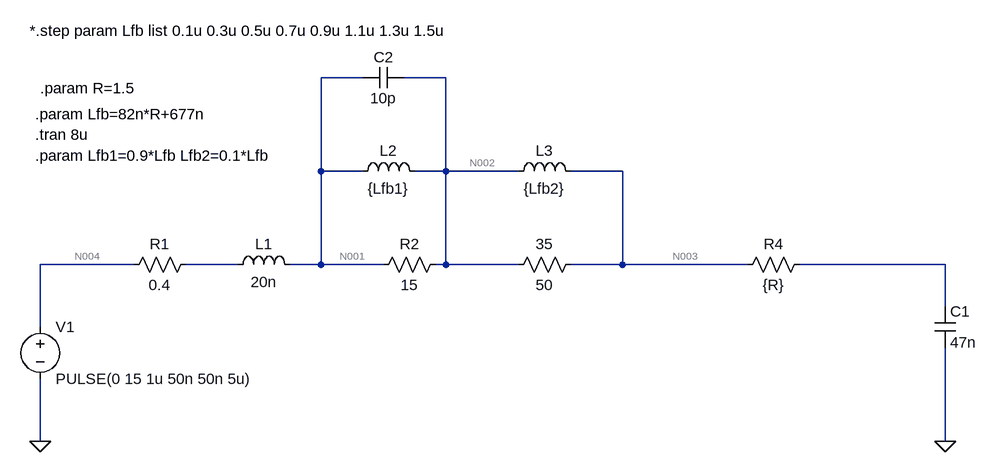
[diagram p0: schematic Draft4.asc]
Draft4.asc, the LTspice schematic file:
Version 4
SHEET 1 1128 680
WIRE 160 -208 96 -208
WIRE 288 -208 224 -208
WIRE 96 -64 96 -208
WIRE 160 -64 96 -64
WIRE 288 -64 288 -208
WIRE 288 -64 240 -64
WIRE 400 -64 288 -64
WIRE 560 -64 480 -64
WIRE -192 80 -336 80
WIRE -32 80 -112 80
WIRE 96 80 96 -64
WIRE 96 80 48 80
WIRE 192 80 96 80
WIRE 288 80 288 -64
WIRE 288 80 272 80
WIRE 400 80 288 80
WIRE 560 80 560 -64
WIRE 560 80 480 80
WIRE 752 80 560 80
WIRE 1056 80 832 80
WIRE 1056 144 1056 80
WIRE -336 176 -336 80
WIRE -336 352 -336 256
WIRE 1056 352 1056 208
FLAG -336 352 0
FLAG 1056 352 0
SYMBOL voltage -336 160 R0
WINDOW 123 0 0 Left 0
WINDOW 39 0 0 Left 0
SYMATTR InstName V1
SYMATTR Value PULSE(0 15 1u 50n 50n 5u)
SYMBOL res -208 96 R270
WINDOW 0 32 56 VTop 2
WINDOW 3 0 56 VBottom 2
SYMATTR InstName R1
SYMATTR Value 0.4
SYMBOL ind -48 96 R270
WINDOW 0 32 56 VTop 2
WINDOW 3 5 56 VBottom 2
SYMATTR InstName L1
SYMATTR Value 20n
SYMATTR SpiceLine Rser=2
SYMBOL res 288 64 R90
WINDOW 0 0 56 VBottom 2
WINDOW 3 32 56 VTop 2
SYMATTR InstName R2
SYMATTR Value 15
SYMBOL ind 144 -48 R270
WINDOW 0 32 56 VTop 2
WINDOW 3 5 56 VBottom 2
SYMATTR InstName L2
SYMATTR Value {Lfb1}
SYMBOL ind 384 -48 R270
WINDOW 0 32 56 VTop 2
WINDOW 3 5 56 VBottom 2
SYMATTR InstName L3
SYMATTR Value {Lfb2}
SYMBOL res 496 64 R90
WINDOW 0 0 56 VBottom 2
WINDOW 3 32 56 VTop 2
SYMATTR InstName 35
SYMATTR Value 50
SYMBOL res 848 64 R90
WINDOW 0 0 56 VBottom 2
WINDOW 3 32 56 VTop 2
SYMATTR InstName R4
SYMATTR Value {R}
SYMBOL cap 1040 144 R0
SYMATTR InstName C1
SYMATTR Value 47n
SYMBOL cap 224 -224 R90
WINDOW 0 0 32 VBottom 2
WINDOW 3 32 32 VTop 2
SYMATTR InstName C2
SYMATTR Value 10p
TEXT -344 -120 Left 2 !.tran 8u
TEXT -344 -152 Left 2 !.param Lfb=82n*R+677n
TEXT -344 -88 Left 2 !.param Lfb1=0.9*Lfb Lfb2=0.1*Lfb
TEXT -352 -280 Left 2 !*.step param Lfb list 0.1u 0.3u 0.5u 0.7u 0.9u 1.1u 1.3u 1.5u
TEXT -336 -192 Left 2 !.param R=1.5

The netlist it stands for:
* Draft4.asc
V1 N004 0 PULSE(0 15 1u 50n 50n 5u)
R1 N004 N005 0.4
L1 N005 N001 20n Rser=2
R2 N002 N001 15
L2 N001 N002 {Lfb1}
L3 N002 N003 {Lfb2}
R§35 N003 N002 50
R4 N006 N003 {R}
C1 N006 0 47n
C2 N002 N001 10p
.tran 8u
.param Lfb=82n*R+677n
.param Lfb1=0.9*Lfb Lfb2=0.1*Lfb
*.step param Lfb list 0.1u 0.3u 0.5u 0.7u 0.9u 1.1u 1.3u 1.5u
.param R=1.5
.backanno
.end

* Results of the author's LTspice run, read from the files saved beside the schematic
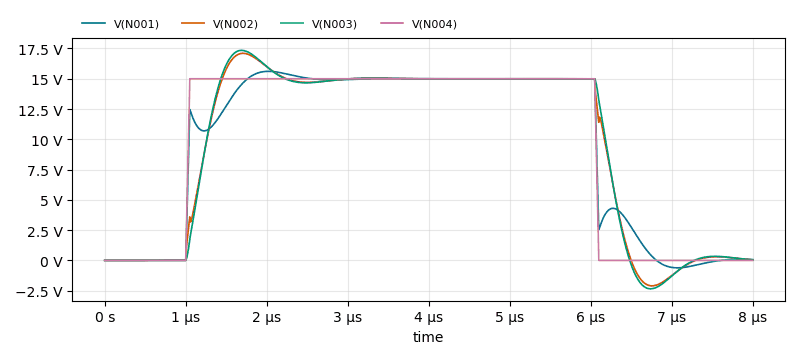
[diagram p1: Transient Analysis of Draft4.asc, plotted from the saved traces]
* Transient Analysis, 1 run:
*   V(N001): min -614.5 mV, max 15.61 V, average 9.468 V, rms 11.71 V, last 74.24 mV
*   V(N002): min -2.101 V, max 17.1 V, average 9.471 V, rms 11.89 V, last 41.1 mV
*   V(N003): min -2.345 V, max 17.35 V, average 9.471 V, rms 11.93 V, last 35.56 mV
*   V(N004): min 0 V, max 15 V, average 9.469 V, rms 11.9 V, last 0 V